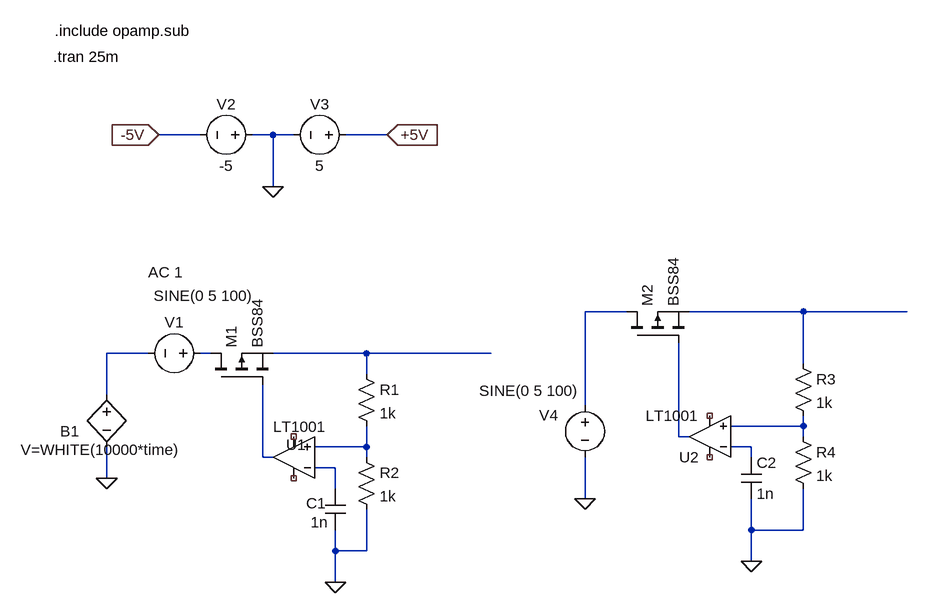
[diagram p0: schematic SimpleLDO.asc]
SimpleLDO.asc, the LTspice schematic file:
Version 4
SHEET 1 1460 968
WIRE 368 -336 304 -336
WIRE 480 -336 448 -336
WIRE 512 -336 480 -336
WIRE 656 -336 592 -336
WIRE 480 -256 480 -336
WIRE 1024 -64 960 -64
WIRE 1296 -64 1120 -64
WIRE 1456 -64 1296 -64
WIRE 288 0 224 0
WIRE 384 0 368 0
WIRE 624 0 480 0
WIRE 816 0 624 0
WIRE 1296 16 1296 -64
WIRE 624 32 624 0
WIRE 224 64 224 0
WIRE 960 80 960 -64
WIRE 1296 112 1296 96
WIRE 1296 112 1184 112
WIRE 1104 128 1104 -16
WIRE 1120 128 1104 128
WIRE 1296 128 1296 112
WIRE 624 144 624 112
WIRE 624 144 544 144
WIRE 1216 144 1184 144
WIRE 464 160 464 48
WIRE 480 160 464 160
WIRE 624 160 624 144
WIRE 1216 160 1216 144
WIRE 576 176 544 176
WIRE 224 192 224 144
WIRE 576 208 576 176
WIRE 960 224 960 160
WIRE 1216 272 1216 224
WIRE 1296 272 1296 208
WIRE 1296 272 1216 272
WIRE 576 304 576 272
WIRE 624 304 624 240
WIRE 624 304 576 304
WIRE 1216 320 1216 272
WIRE 576 352 576 304
FLAG 224 192 0
FLAG 576 352 0
FLAG 480 -256 0
FLAG 304 -336 -5V
IOPIN 304 -336 In
FLAG 656 -336 +5V
IOPIN 656 -336 In
FLAG 1216 320 0
FLAG 960 224 0
SYMBOL bv 224 48 R0
WINDOW 0 -71 72 Left 2
WINDOW 3 -132 100 Left 2
SYMATTR InstName B1
SYMATTR Value V=WHITE(10000*time)
SYMBOL voltage 384 0 R90
WINDOW 0 -32 56 VBottom 2
WINDOW 3 -104 11 VTop 2
WINDOW 123 -109 69 VBottom 2
WINDOW 39 0 0 Left 0
SYMATTR InstName V1
SYMATTR Value SINE(0 5 100)
SYMATTR Value2 AC 1
SYMBOL pmos 384 48 R270
SYMATTR InstName M1
SYMATTR Value BSS84
SYMBOL res 608 16 R0
SYMATTR InstName R1
SYMATTR Value 1k
SYMBOL res 608 144 R0
SYMATTR InstName R2
SYMATTR Value 1k
SYMBOL cap 560 208 R0
WINDOW 0 -29 23 Left 2
WINDOW 3 -22 52 Left 2
SYMATTR InstName C1
SYMATTR Value 1n
SYMBOL voltage 464 -336 R90
WINDOW 0 -32 56 VBottom 2
WINDOW 3 32 56 VTop 2
SYMATTR InstName V2
SYMATTR Value -5
SYMBOL voltage 608 -336 R90
WINDOW 0 -32 56 VBottom 2
WINDOW 3 32 56 VTop 2
SYMATTR InstName V3
SYMATTR Value 5
SYMBOL OpAmps\\LT1001 512 224 R180
WINDOW 0 -19 83 Left 2
WINDOW 3 -51 111 Left 2
SYMATTR InstName U1
SYMBOL voltage 960 64 R0
WINDOW 0 -56 47 Bottom 2
WINDOW 3 -86 -22 Top 2
WINDOW 123 -109 69 VBottom 2
WINDOW 39 0 0 Left 0
SYMATTR InstName V4
SYMATTR Value SINE(0 5 100)
SYMBOL pmos 1024 -16 R270
SYMATTR InstName M2
SYMATTR Value BSS84
SYMBOL res 1280 0 R0
SYMATTR InstName R3
SYMATTR Value 1k
SYMBOL res 1280 112 R0
SYMATTR InstName R4
SYMATTR Value 1k
SYMBOL cap 1200 160 R0
SYMATTR InstName C2
SYMATTR Value 1n
SYMBOL OpAmps\\LT1001 1152 192 R180
SYMATTR InstName U2
TEXT 142 -456 Left 2 !.tran 25m
TEXT 144 -496 Left 2 !.include opamp.sub

The netlist it stands for:
* SimpleLDO.asc
B1 N003 0 V=WHITE(10000*time)
V1 N004 N003 SINE(0 5 100) AC 1
M1 N004 N010 N005 N005 BSS84
R1 N005 N008 1k
R2 N008 0 1k
C1 N011 0 1n
V2 0 -5V -5
V3 +5V 0 5
XU1 N008 N011 NC_01 NC_02 N010 LT1001  ; pins In+ In- V+ V- OUT
V4 N001 0 SINE(0 5 100)
M2 N001 N007 N002 N002 BSS84
R3 N002 N006 1k
R4 N006 0 1k
C2 N009 0 1n
XU2 N006 N009 NC_03 NC_04 N007 LT1001  ; pins In+ In- V+ V- OUT
.model NMOS NMOS
.model PMOS PMOS
.lib standard.mos
.tran 25m
.include opamp.sub
.lib LTC.lib
.backanno
.end